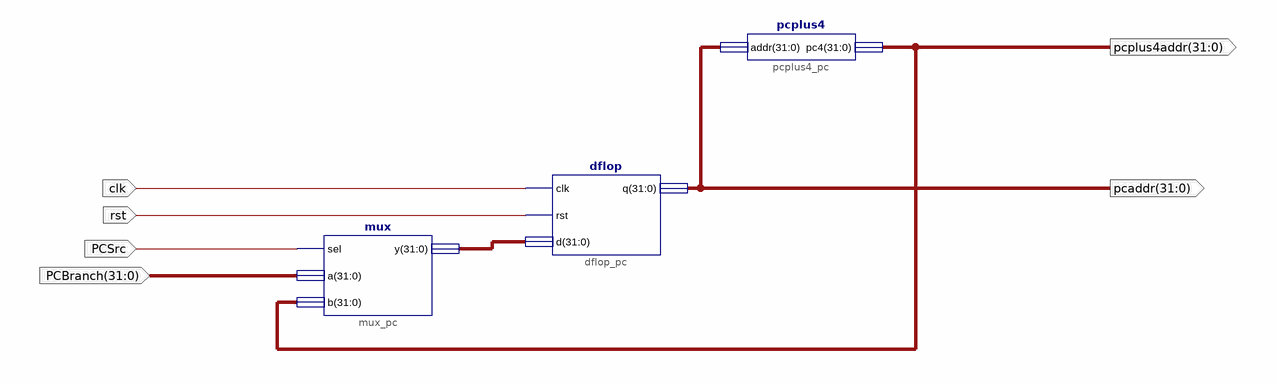
[diagram p0: schematic sheet 1]
// Xilinx ISE schematic pc.sch (spartan3a) as structural Verilog: 3 symbols, 6 ports
module pc (
  input  PCSrc,
  input  [31:0] PCBranch,
  input  clk,
  input  rst,
  output [31:0] pcaddr,
  output [31:0] pcplus4addr
);

  wire [31:0] XLXN_1;

  dflop dflop_pc (.clk(clk), .rst(rst), .d(XLXN_1), .q(pcaddr));
  pcplus4 pcplus4_pc (.addr(pcaddr), .pc4(pcplus4addr));
  mux mux_pc (.sel(PCSrc), .a(PCBranch), .b(pcplus4addr), .y(XLXN_1));
endmodule
